# Altium schematic sheet adc-optical.SchDoc: ADC-OPTICAL
size A4; DrawnBy: Dylan Vogel; Organization: UTAT SS; DocumentNumber: 3; Revision: 1; SheetNumber: 3; SheetTotal: 7
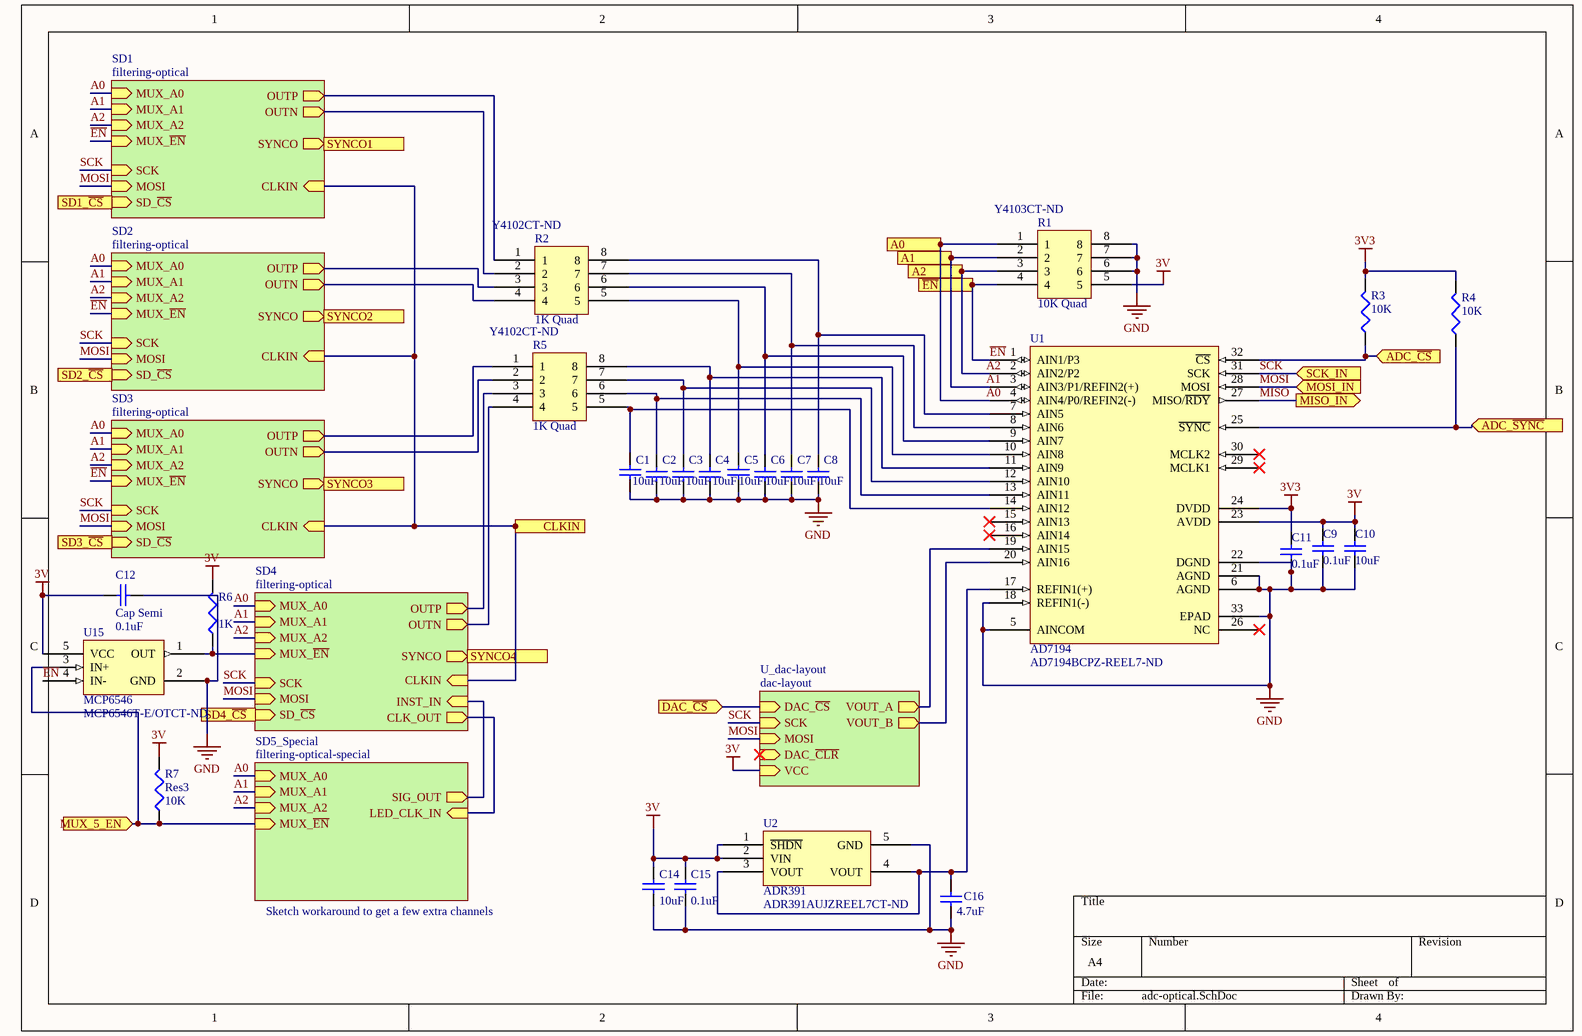
[diagram p0: adc-optical.SchDoc]

## Parts
C1  10uF  [1608[0603]]
C2  10uF  [1608[0603]]
C3  10uF  [1608[0603]]
C4  10uF  [1608[0603]]
C5  10uF  [1608[0603]]
C6  10uF  [1608[0603]]
C7  10uF  [1608[0603]]
C8  10uF  [1608[0603]]
C9  0.1uF  [0402]
C10  10uF  [1608[0603]]
C11  0.1uF  [0402]
C12  Cap Semi  value 0.1uF  [0402]
C14  10uF  [1608[0603]]
C15  0.1uF  [0402]
C16  4.7uF  [1608[0603]]
R1  10K Quad  Supplier Part Number: Y4103CT-ND  [ResQuad-320X150]
R2  1K Quad  Supplier Part Number: Y4102CT-ND  [ResQuad-320X150]
R3  10K  [0402]
R4  10K  [0402]
R5  1K Quad  Supplier Part Number: Y4102CT-ND  [ResQuad-320X150]
R6  value 1K  [0402]  (hidden comment: Res3)
R7  Res3  value 10K  [0402]
U1  AD7194  Supplier Part Number 1: AD7194BCPZ-REEL7-ND  [QFN50P500X500X100-32N]
U2  ADR391  Supplier Part Number 1: ADR391AUJZREEL7CT-ND  [SOT-23-5_95P290X160-5N]
U15  MCP6546  Supplier Part Number 1: MCP6546T-E/OTCT-ND  [SOT-23-5_95P290X160-5N]

## Sub-sheets
SD1 = filtering-optical: MUX_A0 (in), MUX_A1 (in), MUX_A2 (in), MUX_~{EN} (in), SCK (in), MOSI (in), SD_~{CS} (in), OUTP (out), OUTN (out), SYNCO (out), CLKIN (in)
SD2 = filtering-optical: MUX_A0 (in), MUX_A1 (in), MUX_A2 (in), MUX_~{EN} (in), SCK (in), MOSI (in), SD_~{CS} (in), OUTP (out), OUTN (out), SYNCO (out), CLKIN (in)
SD3 = filtering-optical: MUX_A0 (in), MUX_A1 (in), MUX_A2 (in), MUX_~{EN} (in), SCK (in), MOSI (in), SD_~{CS} (in), OUTP (out), OUTN (out), SYNCO (out), CLKIN (in)
SD4 = filtering-optical: MUX_A0 (in), MUX_A1 (in), MUX_A2 (in), MUX_~{EN} (in), SCK (in), MOSI (in), SD_~{CS} (in), OUTP (out), OUTN (out), SYNCO (out), CLKIN (in), CLK_OUT (out), INST_IN (in)
SD5_Special = filtering-optical-special: MUX_A0 (in), MUX_A1 (in), MUX_A2 (in), MUX_~{EN} (in), SIG_OUT (out), LED_CLK_IN (in)
U_dac-layout = dac-layout: VOUT_A (out), VOUT_B (out), DAC_~{CS} (in), SCK (in), MOSI (in), DAC_~{CLR} (in), VCC (in)

## Ports
A0 (out), A1 (out), A2 (out), ADC_~{CS} (in), ADC_~{SYNC} (in), CLKIN (in), DAC_~{CS} (in), MISO_IN (out), MOSI_IN (in), MUX_5_EN (in), SCK_IN (in), SD1_~{CS} (in), SD2_~{CS} (in), SD3_~{CS} (in), SD4_~{CS} (in), SYNCO1 (out), SYNCO2 (out), SYNCO3 (out), SYNCO4 (out), ~{EN} (out)

## Nets
3V: C9.2 C10.2 C12.2 C14.2 C15.2 R1.5 R6.2 R7.2 U1.23(AVDD) U2.1(~{SHDN}) U2.2(VIN) U15.5(VCC) ; sheet U_dac-layout/VCC
3V3: C11.2 R3.2 R4.2 U1.24(DVDD)
GND: C1.1 C2.1 C3.1 C4.1 C5.1 C6.1 C7.1 C8.1 C9.1 C10.1 C11.1 C12.1 C14.1 C15.1 C16.1 R1.6 R1.7 R1.8 U1.5(AINCOM) U1.6(AGND) U1.18(REFIN1(-)) U1.21(AGND) U1.22(DGND) U1.33(EPAD) U2.5(GND) U15.2(GND)
A0: R1.1 U1.4(AIN4/P0/REFIN2(-)) ; port A0, sheet SD1/MUX_A0, sheet SD2/MUX_A0, sheet SD3/MUX_A0, sheet SD4/MUX_A0, sheet SD5_Special/MUX_A0
A1: R1.2 U1.3(AIN3/P1/REFIN2(+)) ; port A1, sheet SD1/MUX_A1, sheet SD2/MUX_A1, sheet SD3/MUX_A1, sheet SD4/MUX_A1, sheet SD5_Special/MUX_A1
A2: R1.3 U1.2(AIN2/P2) ; port A2, sheet SD1/MUX_A2, sheet SD2/MUX_A2, sheet SD3/MUX_A2, sheet SD4/MUX_A2, sheet SD5_Special/MUX_A2
ADC_~{CS}: R3.1 U1.32(~{CS}) ; port ADC_~{CS}
ADC_~{SYNC}: R4.1 U1.25(~{SYNC}) ; port ADC_~{SYNC}
CLKIN: port CLKIN, sheet SD1/CLKIN, sheet SD2/CLKIN, sheet SD3/CLKIN, sheet SD4/CLKIN
DAC_~{CS}: port DAC_~{CS}, sheet U_dac-layout/DAC_~{CS}
~{EN}: R1.4 U1.1(AIN1/P3) U15.4(IN-) ; port ~{EN}, sheet SD1/MUX_~{EN}, sheet SD2/MUX_~{EN}, sheet SD3/MUX_~{EN}
MISO: U1.27(MISO/~{RDY}) ; port MISO_IN
MOSI: U1.28(MOSI) ; port MOSI_IN, sheet SD1/MOSI, sheet SD2/MOSI, sheet SD3/MOSI, sheet SD4/MOSI, sheet U_dac-layout/MOSI
MUX_5_EN: R7.1 U15.3(IN+) ; port MUX_5_EN, sheet SD5_Special/MUX_~{EN}
SCK: U1.31(SCK) ; port SCK_IN, sheet SD1/SCK, sheet SD2/SCK, sheet SD3/SCK, sheet SD4/SCK, sheet U_dac-layout/SCK
SD1_~{CS}: port SD1_~{CS}, sheet SD1/SD_~{CS}
SD2_~{CS}: port SD2_~{CS}, sheet SD2/SD_~{CS}
SD3_~{CS}: port SD3_~{CS}, sheet SD3/SD_~{CS}
SD4_~{CS}: port SD4_~{CS}, sheet SD4/SD_~{CS}
SYNCO1: port SYNCO1, sheet SD1/SYNCO
SYNCO2: port SYNCO2, sheet SD2/SYNCO
SYNCO3: port SYNCO3, sheet SD3/SYNCO
SYNCO4: port SYNCO4, sheet SD4/SYNCO
NetC1_2: C1.2 R5.5 U1.14(AIN12)
NetC2_2: C2.2 R5.6 U1.13(AIN11)
NetC3_2: C3.2 R5.7 U1.12(AIN10)
NetC4_2: C4.2 R5.8 U1.11(AIN9)
NetC5_2: C5.2 R2.5 U1.10(AIN8)
NetC6_2: C6.2 R2.6 U1.9(AIN7)
NetC7_2: C7.2 R2.7 U1.8(AIN6)
NetC8_2: C8.2 R2.8 U1.7(AIN5)
NetC16_2: C16.2 U1.17(REFIN1(+)) U2.3(VOUT) U2.4(VOUT)
NetR2_1: R2.1 ; sheet SD1/OUTP
NetR2_2: R2.2 ; sheet SD1/OUTN
NetR2_3: R2.3 ; sheet SD2/OUTP
NetR2_4: R2.4 ; sheet SD2/OUTN
NetR5_1: R5.1 ; sheet SD3/OUTP
NetR5_2: R5.2 ; sheet SD3/OUTN
NetR5_3: R5.3 ; sheet SD4/OUTP
NetR5_4: R5.4 ; sheet SD4/OUTN
NetR6_1: R6.1 U15.1(OUT) ; sheet SD4/MUX_~{EN}
NetU1_19: U1.19(AIN15) ; sheet U_dac-layout/VOUT_A
NetU1_20: U1.20(AIN16) ; sheet U_dac-layout/VOUT_B
(unnamed): sheet SD4/CLK_OUT, sheet SD5_Special/LED_CLK_IN
(unnamed): sheet SD4/INST_IN, sheet SD5_Special/SIG_OUT

Not connected (* = marked no-connect by the designer): U1 15(AIN13)* 16(AIN14)* 26(NC)* 29(MCLK1)* 30(MCLK2)*

## Notes on the sheet
- Sketch workaround to get a few extra channels

## Library data of the parts
C1-C12 C14-C16 = Cap Semi: Capacitor (Semiconductor SIM Model); Published: 8-Jun-2000; LatestRevisionDate: 29-May-2009; LatestRevisionNote: IPC-7351 Footprint Added.; PackageReference: C1206; Publisher: Altium Limited; PackageDescription: Chip Capacitor
  C1-C8 C10 C14: Value: 10uF; Supplier: Digi-Key
  C9 C11 C15: Value: 0.1uF; Supplier: Digi-Key
  C16: Value: 4.7uF; Supplier: Digi-Key
R1 R2 R5 = Res Quad Pack: Quad pack resistor; Supplier: Digi-Key
  R1: Value: 10K Quad
  R2 R5: Value: 1K Quad
R3 R4 R6 R7 = Res3: Resistor; Published: 8-Jun-2000; LatestRevisionDate: 29-May-2009; LatestRevisionNote: IPC-7351 Footprint Added.; PackageReference: J1-0603; Publisher: Altium Limited; PackageDescription: Chip Resistor
  R3 R4: Value: 10K; Supplier: Digi-Key
U1 = AD7194: 24-bit sigma-delta ADC; Supplier 1: Digi-Key; Supplier: Digi-Key
U2 = ADR391: 2.5V reference voltage.; Supplier 1: Digi-Key; Supplier: Digi-Key
U15 = MCP6546: Open-drain output sub-microamp comparator.; Supplier 1: Digi-Key